# Altium schematic sheet DAC.SchDoc
size A4; SheetNumber: 6; SheetTotal: 7
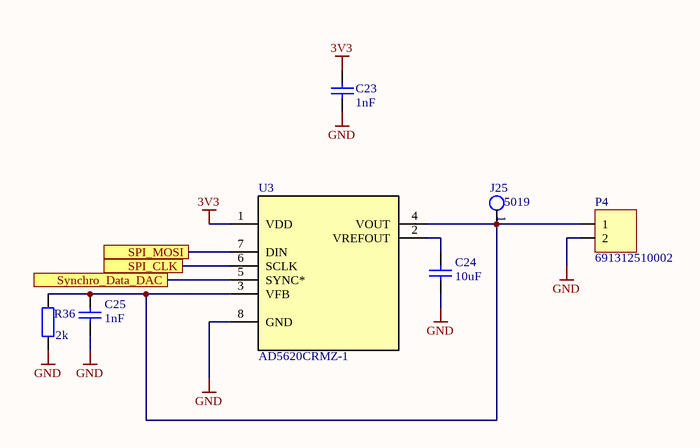
[diagram p0: DAC.SchDoc]

## Parts
C23  1nF  [C0805]
C24  10uF  [C0805]
C25  1nF  [C0805]
J25  5019  [KEYSTONE_5019]
P4  691312510002  [LINX_CONBNC002]
R36  2k  [RESC2012X06M]
U3  AD5620CRMZ-1  [SOP65P490X110-8N]

## Ports
SPI_CLK, SPI_MOSI, Synchro_Data_DAC

## Nets
3V3: C23.2 U3.1(VDD)
GND: C23.1 C24.1 C25.1 P4.2 R36.1 U3.8(GND)
SPI_CLK: U3.6(SCLK) ; port SPI_CLK
SPI_MOSI: U3.7(DIN) ; port SPI_MOSI
Synchro_Data_DAC: U3.5(SYNC*) ; port Synchro_Data_DAC
NetC24_2: C24.2 U3.2(VREFOUT)
NetC25_2: C25.2 J25.1 P4.1 R36.2 U3.3(VFB) U3.4(VOUT)

## Library data of the parts
C23-C25 = Cap: Capacitor; Published: 8-Jun-2000; LatestRevisionDate: 17-Jul-2002; LatestRevisionNote: Re-released for DXP Platform.; PackageReference: RAD-0.3; Publisher: Altium Limited; PackageDescription: Radial Cap, Thru-Hole; 2 Leads; 0.3 in Pin Spacing
  C23 C25: Value: 1nF
  C24: Value: 10uF
J25 = CMP-1672-00008-2: NexarPartId: 22052288; Manufacturer: Keystone Electronics; Number of Contacts: 1; Contact Material: Bronze, Silver; Number of Pins: 1; Lead Free: Lead Free; Packaging: Tape and Reel; Mount: Surface Mount; Height: 2.286mm; Contact Plating: Silver; Material: Bronze; Termination: SMD/SMT; REACH SVHC: No SVHC; RoHS: Compliant; Manufacturer Part Number: 5019
P4 = MHDR1X2: Header, 2-Pin; LatestRevisionDate: 17-Jul-2002; LatestRevisionNote: Re-released for DXP Platform.; Publisher: Altium Limited
R36 = Res2: Resistor; Published: 8-Jun-2000; LatestRevisionDate: 17-Jul-2002; LatestRevisionNote: Re-released for DXP Platform.; PackageReference: AXIAL-0.4; Publisher: Altium Limited; PackageDescription: Axial Device, Thru-Hole; 2 Leads; 0.4 in Pin Spacing; Value: 2k
U3 = AD5620CRMZ-1: Single, 12-Bit nanoDACÂ® with 5 ppm/Â°C On-Chip Reference in SOT-23; MF: Analog Devices; Value: *; Price: None; Package: MSOP-8 Analog Devices; MP: AD5620CRMZ-1; Purchase-URL: https://pricing.snapeda.com/search/part/AD5620CRMZ-1/?ref=eda; SnapEDA_Link: https://www.snapeda.com/parts/AD5620CRMZ-1/Analog+Devices/view-part/?ref=snap; Check_prices: https://www.snapeda.com/parts/AD5620CRMZ-1/Analog+Devices/view-part/?ref=eda; Availability: In Stock